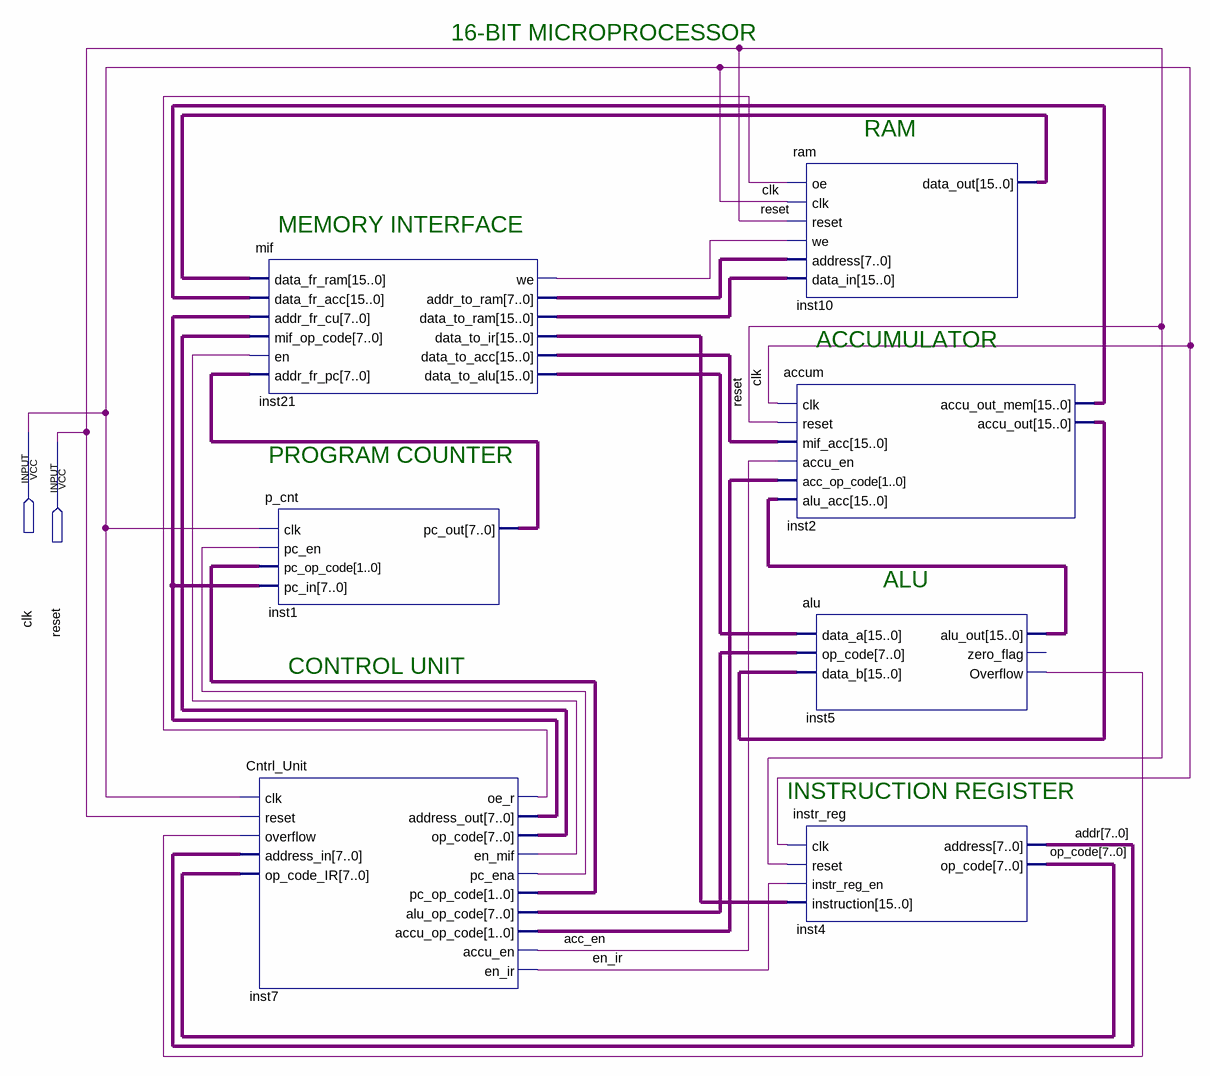
[diagram p0: schematic sheet]
// Quartus schematic md.bdf as structural Verilog: 7 symbols, 2 pins
module md (
  input  clk,
  input  reset
);

  wire acc_en, en_ir, inst5_overflow, inst7_en_mif, inst7_oe_r, inst7_pc_ena, inst21_we;
  wire [1:0] inst7_accu_op_code, inst7_pc_op_code;
  wire [7:0] addr, inst1_pc_out, inst7_address_out, inst7_alu_op_code, inst7_op_code, inst21_addr_to_ram,
       op_code;
  wire [15:0] inst2_accu_out, inst2_accu_out_mem, inst5_alu_out, inst10_data_out, inst21_data_to_acc,
       inst21_data_to_alu, inst21_data_to_ir, inst21_data_to_ram;

  mif inst21 (
    .data_fr_ram(inst10_data_out), .data_fr_acc(inst2_accu_out_mem), .addr_fr_cu(inst7_address_out),
    .mif_op_code(inst7_op_code), .en(inst7_en_mif), .addr_fr_pc(inst1_pc_out), .we(inst21_we),
    .addr_to_ram(inst21_addr_to_ram), .data_to_ram(inst21_data_to_ram), .data_to_ir(inst21_data_to_ir),
    .data_to_acc(inst21_data_to_acc), .data_to_alu(inst21_data_to_alu));
  p_cnt inst1 (
    .clk(clk), .pc_en(inst7_pc_ena), .pc_op_code(inst7_pc_op_code), .pc_in(inst7_address_out),
    .pc_out(inst1_pc_out));
  Cntrl_Unit inst7 (
    .clk(clk), .reset(reset), .address_in(addr), .op_code_IR(op_code), .overflow(inst5_overflow),
    .oe_r(inst7_oe_r), .address_out(inst7_address_out), .op_code(inst7_op_code), .en_mif(inst7_en_mif),
    .pc_ena(inst7_pc_ena), .pc_op_code(inst7_pc_op_code), .alu_op_code(inst7_alu_op_code),
    .accu_op_code(inst7_accu_op_code), .accu_en(acc_en), .en_ir(en_ir));
  ram inst10 (
    .oe(inst7_oe_r), .clk(clk), .reset(reset), .we(inst21_we), .address(inst21_addr_to_ram),
    .data_in(inst21_data_to_ram), .data_out(inst10_data_out));
  accum inst2 (
    .clk(clk), .reset(reset), .mif_acc(inst21_data_to_acc), .accu_en(acc_en),
    .acc_op_code(inst7_accu_op_code), .alu_acc(inst5_alu_out), .accu_out_mem(inst2_accu_out_mem),
    .accu_out(inst2_accu_out));
  alu inst5 (
    .data_a(inst21_data_to_alu), .op_code(inst7_alu_op_code), .data_b(inst2_accu_out),
    .alu_out(inst5_alu_out), .Overflow(inst5_overflow));  // open: zero_flag
  instr_reg inst4 (
    .clk(clk), .reset(reset), .instr_reg_en(en_ir), .instruction(inst21_data_to_ir), .address(addr),
    .op_code(op_code));

  // Notes on the sheet:
  //   16-BIT MICROPROCESSOR
  //   RAM
  //   MEMORY INTERFACE
  //   ACCUMULATOR
  //   PROGRAM COUNTER
  //   ALU
  //   CONTROL UNIT
  //   INSTRUCTION REGISTER
endmodule
